# Altium project SPI-RFLOG V1.0.PrjPcb
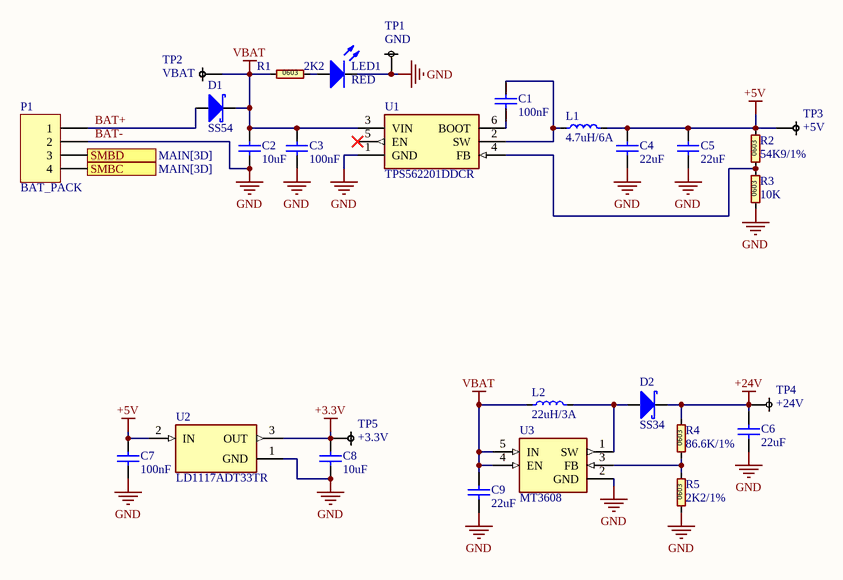
[diagram p0: PSU.SchDoc]
3 sheets, 129 parts. Net scope: flat (ports and power ports of the same name join across sheets).
Board file: RFLOG V1.0.PcbDoc
Sheets:
  PSU.SchDoc
  MAIN.SchDoc
  INTERFACE.SchDoc

## Sheet PSU.SchDoc
size A4; SheetNumber: 1; SheetTotal: 3

### Parts
C1  100nF  [C0603]
C2  10uF  [C1206]
C3  100nF  [C0603]
C4  22uF  [C0603]
C5  22uF  [C0603]
C6  22uF  [C1206]
C7  100nF  [C0603]
C8  10uF  [C1206]
C9  22uF  [C1206]
D1  SS54  [DO-214AC]
D2  SS34  [DO-214AC]
L1  4.7uH/6A  [IND_2926 (7467)]
L2  22uH/3A  [IND_2926 (7467)]
LED1  RED  [LED0603]
P1  BAT_PACK  [JST_XH-2.54]
R1  2K2  [R0603]
R2  54K9/1%  [R0603]
R3  10K  [R0603]
R4  86.6K/1%  [R0603]
R5  2K2/1%  [R0603]
TP1  GND  [PAD]
TP2  VBAT  [PAD]
TP3  +5V  [PAD]
TP4  +24V  [PAD_HOLE]
TP5  +3.3V  [PAD]
U1  TPS562201DDCR  [SOT-23-6]
U2  LD1117ADT33TR  [DPAK]
U3  MT3608  [SOT-23-6]

### Ports
SMBC (see MAIN[3D]), SMBD (see MAIN[3D])

### Nets
+3.3V: C8.2 TP5.1 U2.3(OUT)
+5V: C4.2 C5.2 C7.2 L1.2 R2.2 TP3.1 U2.2(IN)
+24V: C6.2 D2.C(K) R4.2 TP4.1
BAT-: C2.1 C3.1 C4.1 C5.1 C6.1 C7.1 C8.1 C9.1 LED1.2(K) P1.2 R3.1 R5.1 TP1.1 U1.1(GND) U2.1(GND) U3.2(GND)  [also labelled GND]
VBAT: C2.2 C3.2 C9.2 D1.C(K) L2.1 R1.1 TP2.1 U1.3(VIN) U3.4(EN) U3.5(IN)
BAT+: D1.A P1.1
NetC1_1: C1.1 U1.6(BOOT)
NetC1_2: C1.2 L1.1 U1.2(SW)
NetD2_A: D2.A L2.2 U3.1(SW)
NetJP2_1: P1.3 ; port SMBD
NetJP3_1: P1.4 ; port SMBC
NetLED1_1: LED1.1(A) R1.2
NetR2_1: R2.1 R3.2 U1.4(FB)
NetR4_1: R4.1 R5.2 U3.3(FB)

Not connected (* = marked no-connect by the designer): U1 5(EN)*

### Notes on the sheet
- Title:
- Author:
- Checked:
- Approved:
- Edited:
- CONFIDENTIAL
- Notes :
- Prj:
- github.com/abmnyy/about <https://github.com/abmnyy/about>
- Date:
- Version:
- Size:
- A4
- (in symbol Resistor 0603 (Inch)) 0603

### Library data of the parts
C1 = Capacitor 0603 (Inch): 0603 SMD Non-Polarity Capacitor; MFR.Part #: CC1206KRX7R9BB104; LCSC Part #: C82601; ComponentLink1Description: Datasheet; ComponentLink1URL: *
C2 = Capacitor 1206 (Inch): 1206 SMD Non-Polarity Capacitor; MFR.Part #: CC1206KKX5R9BB106; LCSC Part #: C100122; ComponentLink1Description: Datasheet; ComponentLink1URL: *
C3 C7 = Capacitor 0603 (Inch): 0603 SMD Non-Polarity Capacitor; MFR.Part #: *; LCSC Part #: *; ComponentLink1Description: Datasheet; ComponentLink1URL: *
C4 C5 = Capacitor 0603 (Inch): 0603 SMD Non-Polarity Capacitor; MFR.Part #: GRM188R61A226ME15D; LCSC Part #: C84419; ComponentLink1Description: Datasheet
  C4: ComponentLink1URL: *
  C5: ComponentLink1URL: https://www.lcsc.com/datasheet/C84419.pdf
C6 C9 = Capacitor 1206 (Inch): 1206 SMD Non-Polarity Capacitor; MFR.Part #: CC1206KKX5R8BB226; LCSC Part #: C2178233; ComponentLink1Description: Datasheet; ComponentLink1URL: *
C8 = Capacitor 1206 (Inch): 1206 SMD Non-Polarity Capacitor; MFR.Part #: *; LCSC Part #: *; ComponentLink1Description: Datasheet; ComponentLink1URL: *
D1 = SS54: 40V Independent 550mV@5A 5A SMA(DO-214AC) Schottky Diodes; MFR.Part #: SS54; LCSC Part #: C22452; ComponentLink1Description: Datasheet; ComponentLink1URL: https://www.lcsc.com/datasheet/C22452.pdf
D2 = SS34: Schottky SS34 DO-214AC; MFR.Part #: SS34; LCSC Part #: C3040628; ComponentLink1Description: Datasheet; ComponentLink1URL: https://www.lcsc.com/datasheet/C3040628.pdf
L1 = INDUCTOR 2926: Inductor with Package: 2926 (7467); MFR.Part #: FXL0630-4R7-M; LCSC Part #: C167220; ComponentLink1Description: Datasheet; ComponentLink1URL: https://www.lcsc.com/datasheet/C167220.pdf
L2 = INDUCTOR 2926: Inductor with Package: 2926 (7467); MFR.Part #: YSPI0630A-220M; LCSC Part #: C497873; ComponentLink1Description: Datasheet; ComponentLink1URL: https://www.lcsc.com/datasheet/C497873.pdf
LED1 = LED 0603: 0603 LED; MFR.Part #: KT-0603R; LCSC Part #: C2286; ComponentLink1Description: Datasheet; ComponentLink1URL: *
P1 = Connector 4P: CONNECTOR HEADER; LatestRevisionDate: 17-Jul-2002; LatestRevisionNote: Re-released for DXP Platform.; Publisher: Altium Limited
R1 R5 = Resistor 0603 (Inch): 0603 SMD Thick Resistor; MFR.Part #: RC0603JR-072K2L; LCSC Part #: C113303; ComponentLink1Description: Datasheet; ComponentLink1URL: *
R2 = Resistor 0603 (Inch): 0603 SMD Thick Resistor; MFR.Part #: RC0603FR-0754K9L; LCSC Part #: C185321; ComponentLink1Description: Datasheet; ComponentLink1URL: https://www.lcsc.com/datasheet/C185321.pdf
R3 = Resistor 0603 (Inch): 0603 SMD Thick Resistor; MFR.Part #: RC0603FR-0710KL; LCSC Part #: C98220; ComponentLink1Description: Datasheet; ComponentLink1URL: *
R4 = Resistor 0603 (Inch): 0603 SMD Thick Resistor; MFR.Part #: RC0603FR-0786K6L; LCSC Part #: C141683; ComponentLink1Description: Datasheet; ComponentLink1URL: https://www.lcsc.com/datasheet/C141683.pdf
TP1-TP5 = Test Point: Thick Pad
U1 = TPS562201DDCR: 4.5 V to 17 V input, 2 A output, synchronous step-down converter in Eco-mode; MFR.Part #: TPS562201DDCR; LCSC Part #: C90061; ComponentLink1Description: Datasheet; ComponentLink1URL: https://www.lcsc.com/datasheet/C90061.pdf
U2 = LD1117ADT33TR: Linear Voltage Regulator IC Positive Fixed 1 Output 3.3V 1A; MFR.Part #: LD1117ADT33TR; LCSC Part #: C157401; ComponentLink1Description: Datasheet; ComponentLink1URL: https://www.lcsc.com/datasheet/C157401.pdf
U3 = MT3608: High Efficiency 1.2MHz2A Step Up Converter; MFR.Part #: MT3608; LCSC Part #: C84817; ComponentLink1Description: Datasheet; ComponentLink1URL: https://www.lcsc.com/datasheet/C84817.pdf

## Sheet MAIN.SchDoc
size A4; SheetNumber: 2; SheetTotal: 3
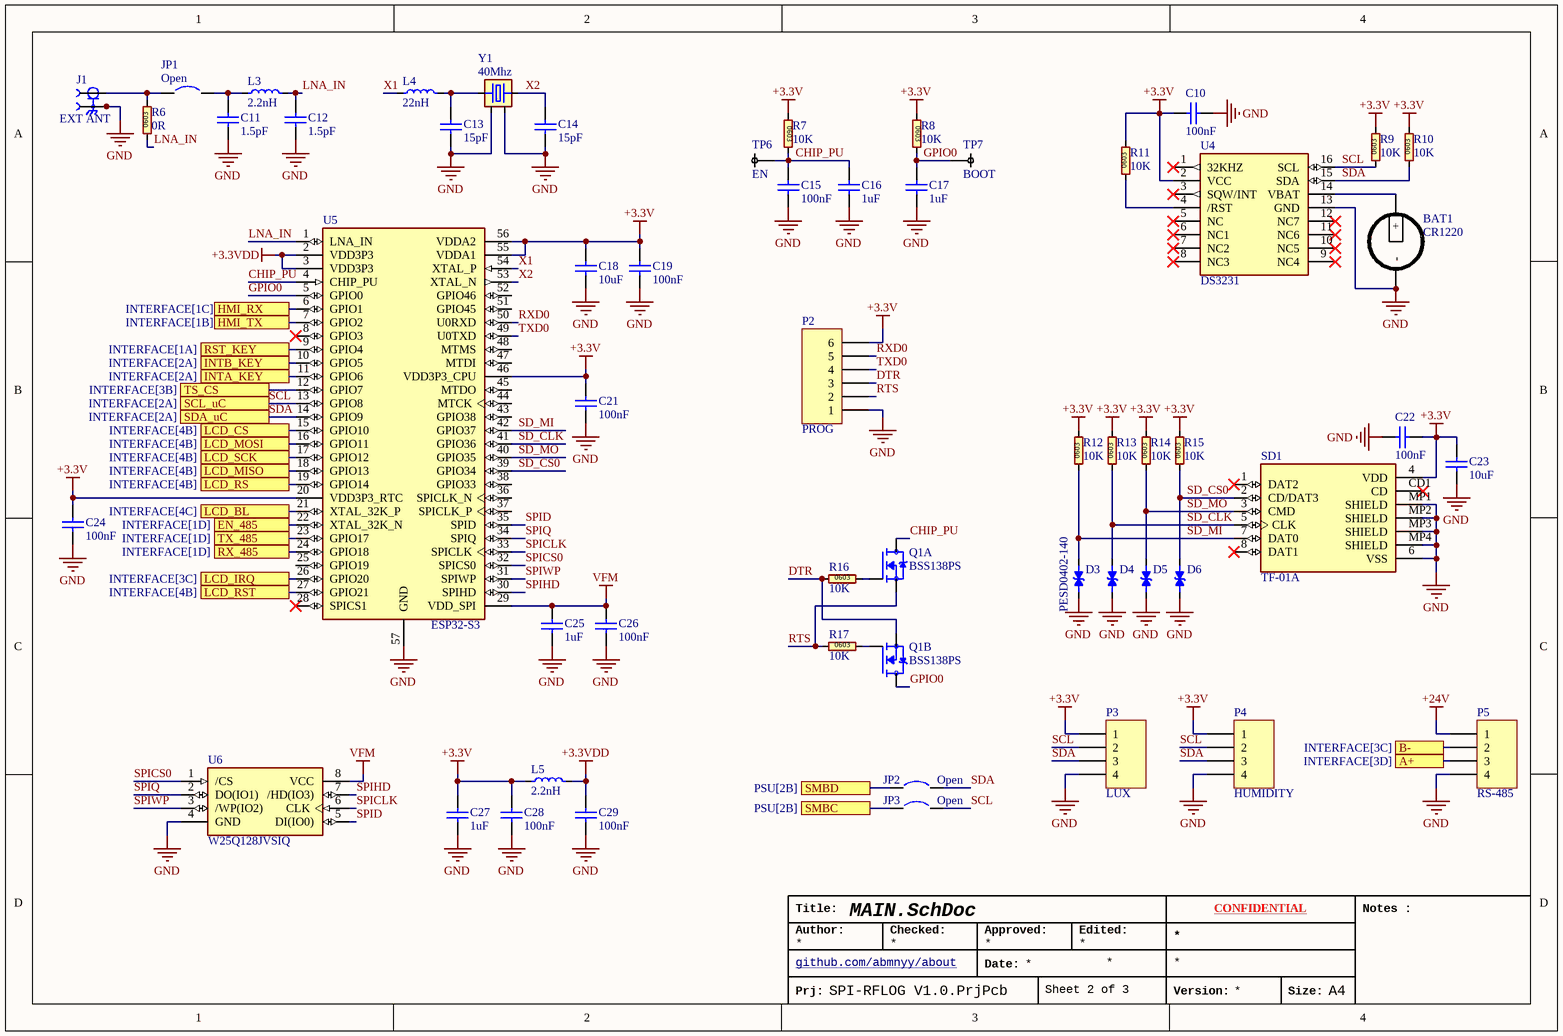
[diagram p1: MAIN.SchDoc]

### Parts
BAT1  CR1220  [MPD_BC501SM-TR]
C10  100nF  [C0603]
C11  1.5pF  [C0603]
C12  1.5pF  [C0603]
C13  15pF  [C0603]
C14  15pF  [C0603]
C15  100nF  [C0603]
C16  1uF  [C0603]
C17  1uF  [C0603]
C18  10uF  [C0603]
C19  100nF  [C0603]
C21  100nF  [C0603]
C22  100nF  [C0603]
C23  10uF  [C0603]
C24  100nF  [C0603]
C25  1uF  [C0603]
C26  100nF  [C0603]
C27  1uF  [C0603]
C28  100nF  [C0603]
C29  100nF  [C0603]
D3  PESD0402-140  [ESD0402]
D4  PESD0402-140  [ESD0402]  (value not drawn)
D5  PESD0402-140  [ESD0402]  (value not drawn)
D6  PESD0402-140  [ESD0402]  (value not drawn)
J1  EXT ANT  [IPEX_UF.L]
JP1  Open  [SB_STM]
JP2  Open  [SB_STM]
JP3  Open  [SB_STM]
L3  2.2nH  [L0603]
L4  22nH  [L0603]
L5  2.2nH  [L0603]
P2  PROG  [HDR-6P-2.54mm]
P3  LUX  [JST_XH-2.54]
P4  HUMIDITY  [JST_XH-2.54]
P5  RS-485  [JST_XH-2.54]
Q1  BSS138PS  [SOT-363]  (parts A,B of 2)
R6  0R  [R0603]
R7  10K  [R0603]
R8  10K  [R0603]
R9  10K  [R0603]
R10  10K  [R0603]
R11  10K  [R0603]
R12  10K  [R0603]
R13  10K  [R0603]
R14  10K  [R0603]
R15  10K  [R0603]
R16  10K  [R0603]
R17  10K  [R0603]
SD1  TF-01A  [TF-01A]
TP6  EN  [PAD]
TP7  BOOT  [PAD]
U4  DS3231  [SOIC-16-WIDE]
U5  ESP32-S3  [ESP32-S3]
U6  W25Q128JVSIQ  [SOIC-8-208miL]
Y1  40Mhz  [OSC_SMD3225-4]

### Ports
A+ (see INTERFACE[3D]), B- (see INTERFACE[3C]), EN_485 (see INTERFACE[1D]), HMI_RX (see INTERFACE[1C]), HMI_TX (see INTERFACE[1B]), INTA_KEY (see INTERFACE[2A]), INTB_KEY (see INTERFACE[2A]), LCD_BL (see INTERFACE[4C]), LCD_CS (see INTERFACE[4B]), LCD_IRQ (see INTERFACE[3C]), LCD_MISO (see INTERFACE[4B]), LCD_MOSI (see INTERFACE[4B]), LCD_RS (see INTERFACE[4B]), LCD_RST (see INTERFACE[4B]), LCD_SCK (see INTERFACE[4B]), RST_KEY (see INTERFACE[1A]), RX_485 (see INTERFACE[1D]), SCL_uC (see INTERFACE[2A]), SDA_uC (see INTERFACE[2A]), SMBC (see PSU[2B]), SMBD (see PSU[2B]), TS_CS (see INTERFACE[3B]), TX_485 (see INTERFACE[1D])

### Nets
+3.3V: C10.2 C18.2 C19.2 C21.2 C22.1 C23.2 C24.2 C27.2 C28.2 L5.1 P2.6 P3.1 P4.1 R7.1 R8.1 R9.2 R10.2 R11.2 R12.2 R13.2 R14.2 R15.2 SD1.4(VDD) U4.2(VCC) U5.20(VDD3P3_RTC) U5.46(VDD3P3_CPU) U5.55(VDDA1) U5.56(VDDA2)
+3.3VDD: C29.2 L5.2 U5.2(VDD3P3) U5.3(VDD3P3)
+24V: P5.1
GND: BAT1.- C10.1 C11.1 C12.1 C13.1 C14.1 C15.2 C16.2 C17.2 C18.1 C19.1 C21.1 C22.2 C23.1 C24.1 C25.1 C26.1 C27.1 C28.1 C29.1 D3.1 D4.1 D5.1 D6.1 J1.2(GROUND) J1.3(GROUND) P2.1 P3.4 P4.4 P5.4 SD1.6(VSS) SD1.MP1(SHIELD) SD1.MP2(SHIELD) SD1.MP3(SHIELD) SD1.MP4(SHIELD) U4.13(GND) U5.57(GND) U6.4(GND) Y1.2(GND) Y1.4(GND)  [project net BAT-]
VFM: C25.2 C26.2 U5.29(VDD_SPI) U6.8(VCC)
CHIP_PU: C15.1 C16.1 Q1.6(D1) R7.2 TP6.1 U5.4(CHIP_PU)
DTR: P2.3 Q1.4(S2) R16.1
GPIO0: C17.1 Q1.3(D2) R8.2 TP7.1 U5.5(GPIO0)
LNA_IN: C12.2 L3.2 R6.1 U5.1(LNA_IN)
RTS: P2.2 Q1.1(S1) R17.1
RXD0: P2.5 U5.50(U0RXD)
SCL: JP3.2 P3.2 P4.2 R9.1 U4.16(SCL) U5.13(GPIO8) ; port SCL_uC
SD_CLK: D4.2 R13.1 SD1.5(CLK) U5.41(GPIO36)
SD_CS0: D6.2 R15.1 SD1.2(CD/DAT3) U5.39(GPIO34)
SD_MI: D3.2 R12.1 SD1.7(DAT0) U5.42(GPIO37)
SD_MO: D5.2 R14.1 SD1.3(CMD) U5.40(GPIO35)
SDA: JP2.2 P3.3 P4.3 R10.1 U4.15(SDA) U5.14(GPIO9) ; port SDA_uC
SPICLK: U5.33(SPICLK) U6.6(CLK)
SPICS0: U5.32(SPICS0) U6.1(/CS)
SPID: U5.35(SPID) U6.5(DI(IO0))
SPIHD: U5.30(SPIHD) U6.7(/HD(IO3))
SPIQ: U5.34(SPIQ) U6.2(DO(IO1))
SPIWP: U5.31(SPIWP) U6.3(/WP(IO2))
TS_MISO: U5.18(GPIO13) ; port LCD_MISO
TS_MOSI: U5.16(GPIO11) ; port LCD_MOSI
TS_SCK: U5.17(GPIO12) ; port LCD_SCK
TXD0: P2.4 U5.49(U0TXD)
X1: L4.1 U5.54(XTAL_P)
X2: C14.2 U5.53(XTAL_N) Y1.3(OSC2)
NetBAT1_+: BAT1.+ U4.14(VBAT)
NetC11_2: C11.2 JP1.2 L3.1
NetC13_2: C13.2 L4.2 Y1.1(OSC1)
NetF1_2: P5.2 ; port B-
NetF2_2: P5.3 ; port A+
NetIC1_11: U5.26(GPIO20) ; port LCD_IRQ
NetIC1_15: U5.12(GPIO7) ; port TS_CS
NetJ1_1: J1.1(SIGNAL) JP1.1 R6.2
NetJ2_9: U5.15(GPIO10) ; port LCD_CS
NetJ2_10: U5.19(GPIO14) ; port LCD_RS
NetJ2_15: U5.27(GPIO21) ; port LCD_RST
NetJP2_1: JP2.1 ; port SMBD
NetJP3_1: JP3.1 ; port SMBC
NetQ1_2: Q1.2(G1) R16.2
NetQ1_5: Q1.5(G2) R17.2
NetQ2_1: U5.7(GPIO2) ; port HMI_TX
NetQ2_4: U5.6(GPIO1) ; port HMI_RX
NetR11_1: R11.1 U4.4(/RST)
NetR18_1: U5.10(GPIO5) ; port INTB_KEY
NetR19_1: U5.11(GPIO6) ; port INTA_KEY
NetR20_1: U5.9(GPIO4) ; port RST_KEY
NetR26_2: U5.21(XTAL_32K_P) ; port LCD_BL
NetR30_1: U5.23(GPIO17) ; port TX_485
NetR31_1: U5.22(XTAL_32K_N) ; port EN_485
NetR32_1: U5.24(GPIO18) ; port RX_485

Not connected (* = marked no-connect by the designer): SD1 1(DAT2)* 8(DAT1)* CD1(CD)*; U4 1(32KHZ)* 3(SQW/INT)* 5(NC)* 6(NC1)* 7(NC2)* 8(NC3)* 9(NC4)* 10(NC5)* 11(NC6)* 12(NC7)*; U5 8(GPIO3)* 25(GPIO19) 28(SPICS1)* 36(SPICLK_N) 37(SPICLK_P) 38(GPIO33) 43(GPIO38) 44(MTCK) 45(MTDO) 47(MTDI) 48(MTMS) 51(GPIO45) 52(GPIO46)

### Notes on the sheet
- Title:
- Author:
- Checked:
- Approved:
- Edited:
- CONFIDENTIAL
- Notes :
- Prj:
- github.com/abmnyy/about <https://github.com/abmnyy/about>
- Date:
- Version:
- Size:
- A4
- (in symbol Resistor 0603 (Inch)) 0603

### Library data of the parts
BAT1 = CR1220 HOLDER: BATTERY HOLDER; MFR.Part #: BC501SM; LCSC Part #: C5439670; ComponentLink1Description: Datasheet; ComponentLink1URL: https://www.lcsc.com/datasheet/lcsc_datasheet_2410121528_MPD--Memory-Protection-Devices-BC501SM_C5439670.pdf
C10 C15 C19 C21-C29 = Capacitor 0603 (Inch): 0603 SMD Non-Polarity Capacitor; MFR.Part #: *; LCSC Part #: *; ComponentLink1Description: Datasheet; ComponentLink1URL: *
C11 C12 = Capacitor 0603 (Inch): 0603 SMD Non-Polarity Capacitor; MFR.Part #: CC0603CRNPO9BN1R5; LCSC Part #: C163551; ComponentLink1Description: Datasheet
  C11: ComponentLink1URL: https://www.lcsc.com/datasheet/C163551.pdf
  C12: ComponentLink1URL: *
C13 C14 = Capacitor 0603 (Inch): 0603 SMD Non-Polarity Capacitor; MFR.Part #: X322540MPB4SI; LCSC Part #: C9010; ComponentLink1Description: Datasheet
  C13: ComponentLink1URL: https://www.lcsc.com/datasheet/C9010.pdf
  C14: ComponentLink1URL: *
C16 C17 = Capacitor 0603 (Inch): 0603 SMD Non-Polarity Capacitor; MFR.Part #: CC0603KRX7R7BB105; LCSC Part #: C106248; ComponentLink1Description: Datasheet; ComponentLink1URL: *
C18 = Capacitor 0603 (Inch): 0603 SMD Non-Polarity Capacitor; MFR.Part #: CC0603MRX5R7BB106; LCSC Part #: C109457; ComponentLink1Description: Datasheet; ComponentLink1URL: *
D3-D6 = PESD0402-140: 40V Bidirectional 14V 0402 ESD and Surge Protection (TVS/ESD) ROHS; MFR.Part #: PESD0402-140; LCSC Part #: C10662
  D3: ComponentLink1Description: Datasheet; ComponentLink1URL: https://www.lcsc.com/datasheet/C10662.pdf
J1 = IPEX UF.L: 1 POS Vertical SMD Small form factor with big performance through 6 GHz connector,MHF, RF, micro-coaxial MHF I Receptacle; MFR.Part #: KH-IPEX-K501-29; LCSC Part #: C411563; ComponentLink1Description: Datasheet; ComponentLink1URL: https://www.lcsc.com/datasheet/C411563.pdf
JP1-JP3 = Jumper Solder: Jumper Solder Pad; Published: 24-Mar-1999; Revision: July-2002: Re-released for DXP Platform.; Publisher: Altium Limited
L3 = INDUCTOR 0603: Inductor with Package: 0603 Inch; MFR.Part #: *; LCSC Part #: *; ComponentLink1Description: Datasheet; ComponentLink1URL: *
L4 = INDUCTOR 0603: Inductor with Package: 0603 Inch; MFR.Part #: VHF160808H22NJT; LCSC Part #: C90207; ComponentLink1Description: Datasheet; ComponentLink1URL: https://www.lcsc.com/datasheet/C90207.pdf
L5 = INDUCTOR 0603: Inductor with Package: 0603 Inch; MFR.Part #: LQW18AN2N2C80D; LCSC Part #: C71648; ComponentLink1Description: Datasheet; ComponentLink1URL: https://www.lcsc.com/datasheet/C71648.pdf
P2 = Header 6: Header, 6-Pin; LatestRevisionDate: 17-Jul-2002; LatestRevisionNote: Re-released for DXP Platform.; Publisher: Altium Limited
P3-P5 = Connector 4P: CONNECTOR HEADER; LatestRevisionDate: 17-Jul-2002; LatestRevisionNote: Re-released for DXP Platform.; Publisher: Altium Limited
Q1 = BSS138PS: 60 V, 320 mA dual N-channel Trench MOSFET; MFR.Part #: BSS138PS,115; LCSC Part #: C193381; ComponentLink1Description: Datasheet; ComponentLink1URL: https://www.lcsc.com/datasheet/lcsc_datasheet_2410121736_Nexperia-BSS138PS-115_C193381.pdf
R6 = Resistor 0603 (Inch): 0603 SMD Thick Resistor; MFR.Part #: AC0603FR-070RL; LCSC Part #: C116699; ComponentLink1Description: Datasheet; ComponentLink1URL: *
R7-R17 = Resistor 0603 (Inch): 0603 SMD Thick Resistor; MFR.Part #: *; LCSC Part #: *; ComponentLink1Description: Datasheet; ComponentLink1URL: *
SD1 = TF-01A: Standard Card Edge Connectors; LCSC Part #: C2889258; MFR.Part #: TF-01A; ComponentLink1Description: Datasheet; ComponentLink1URL: https://www.lcsc.com/datasheet/C2889258.pdf
TP6 TP7 = Test Point: Thick Pad
U4 = DS3231: Real Time Clock (RTC) IC Clock/Calendar - IÂ²C, 2-Wire Serial 8-SOIC (0.154, 3.90mm Width); MFR.Part #: DS3231SN#T&R; LCSC Part #: C9866; ComponentLink1Description: Datasheet; ComponentLink1URL: https://www.lcsc.com/datasheet/C9866.pdf
U5 = ESP32-S3: IC RF TxRx + MCU Bluetooth, WiFi 802.11b/g/n, Bluetooth v5.0 2.412GHz ~ 2.484GHz 56-VFQFN Exposed Pad; MFR.Part #: ESP32-S3R8; LCSC Part #: C2913194; ComponentLink1Description: Datasheet; ComponentLink1URL: https://www.lcsc.com/datasheet/C2913194.pdf
U6 = W25Q128JVSIQ: FLASH - NOR Memory IC 128Mb (16M x 8) SPI - Quad I/O, QPI, DTR 133 MHz 8-SOIC; MFR.Part #: W25Q128JVSIQ; LCSC Part #: C97521; ComponentLink1Description: Datasheet; ComponentLink1URL: https://www.lcsc.com/datasheet/C97521.pdf
Y1 = XTAL-40Mhz: 40MHz Crystal Oscillator 15pF ±10ppm ±20ppm SMD3225-4P Crystals ROHS; MFR.Part #: X322540MPB4SI; LCSC Part #: C9010; ComponentLink1Description: Datasheet; ComponentLink1URL: https://www.lcsc.com/datasheet/C9010.pdf

## Sheet INTERFACE.SchDoc
size A4; SheetNumber: 3; SheetTotal: 3
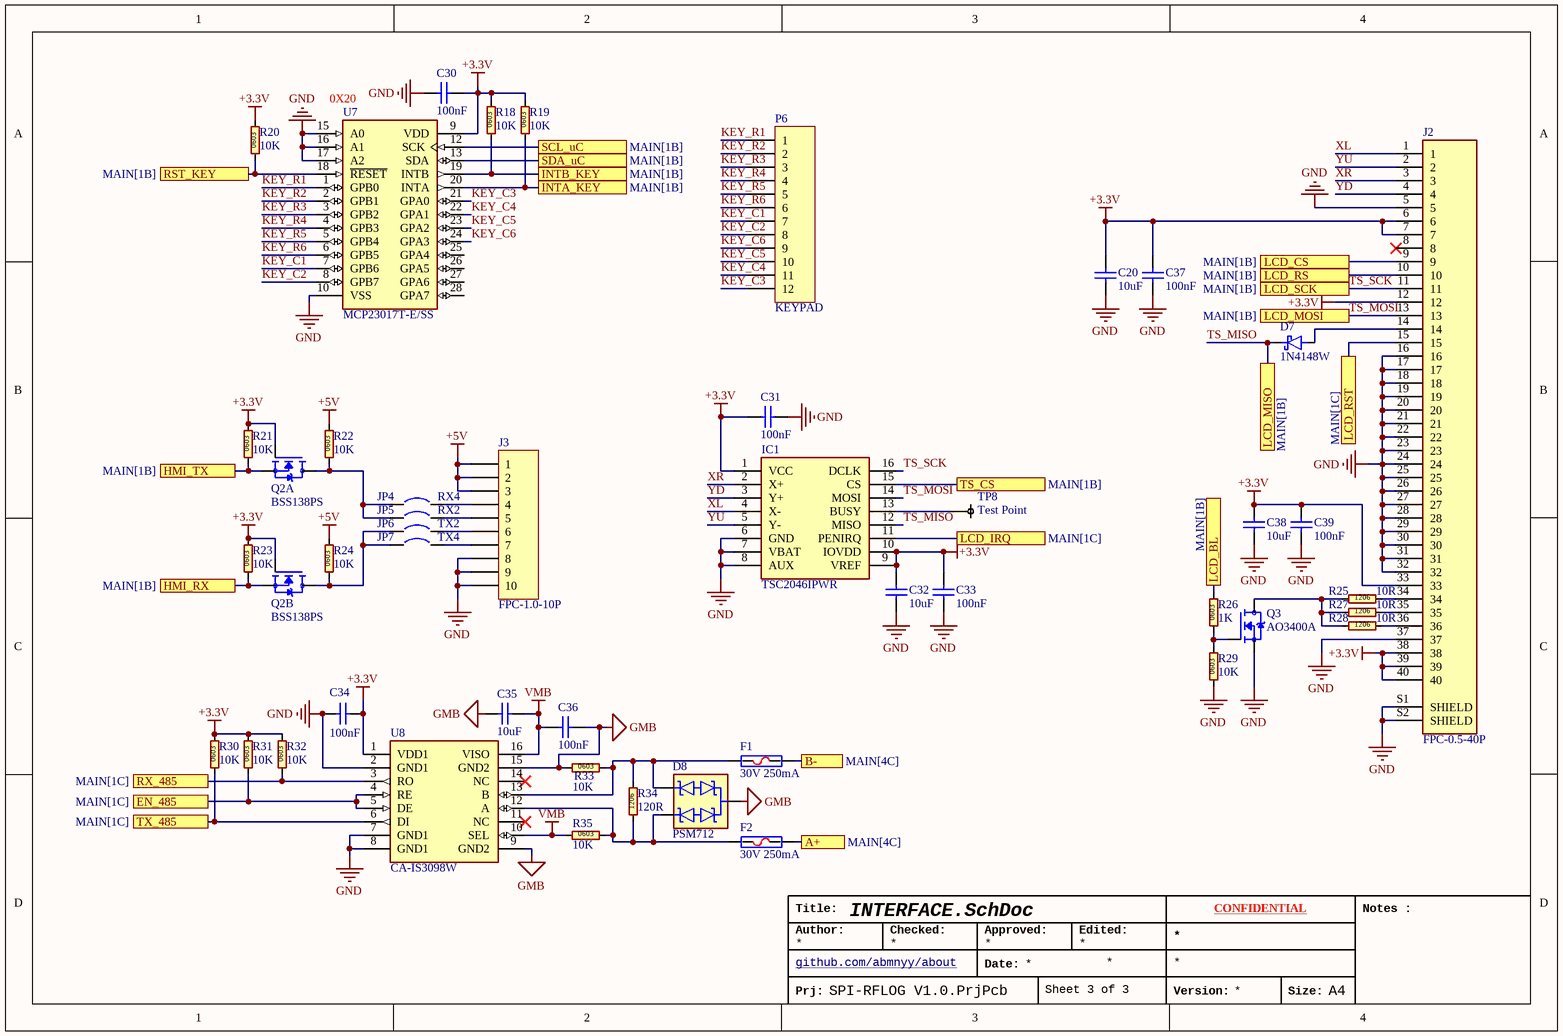
[diagram p2: INTERFACE.SchDoc]

### Parts
C20  10uF  [C0603]
C30  100nF  [C0603]
C31  100nF  [C0603]
C32  10uF  [C0603]
C33  100nF  [C0603]
C34  100nF  [C0603]
C35  10uF  [C0603]
C36  100nF  [C0603]
C37  100nF  [C0603]
C38  10uF  [C0603]
C39  100nF  [C0603]
D7  1N4148W  [SOD-123F]
D8  PSM712  [SOT-23-3]
F1  30V 250mA  [PPTC-1206]
F2  30V 250mA  [PPTC-1206]
IC1  TSC2046IPWR  [TSSOP-16]
J2  FPC-0.5-40P  [FPC_0.5_40P - TOP CONTACT - duplicate]
J3  FPC-1.0-10P  [FPC_1.0_10P - BOTTOM CONTACT]
JP4  RX4  [SB_STM]
JP5  RX2  [SB_STM]
JP6  TX2  [SB_STM]
JP7  TX4  [SB_STM]
P6  KEYPAD  [HDR-12P-2.54mm]
Q2  BSS138PS  [SOT-363]  (parts A,B of 2)
Q3  AO3400A  [SOT-23-3]
R18  10K  [R0603]
R19  10K  [R0603]
R20  10K  [R0603]
R21  10K  [R0603]
R22  10K  [R0603]
R23  10K  [R0603]
R24  10K  [R0603]
R25  10R  [R1206]
R26  1K  [R0603]
R27  10R  [R1206]
R28  10R  [R1206]
R29  10K  [R0603]
R30  10K  [R0603]
R31  10K  [R0603]
R32  10K  [R0603]
R33  10K  [R0603]
R34  120R  [R1206]
R35  10K  [R0603]
TP8  Test Point  [PAD]
U7  MCP23017T-E/SS  [SSOP-28]
U8  CA-IS3098W  [SOIC-16-WIDE]

### Ports
A+ (see MAIN[4C]), B- (see MAIN[4C]), EN_485 (see MAIN[1C]), HMI_RX (see MAIN[1B]), HMI_TX (see MAIN[1B]), INTA_KEY (see MAIN[1B]), INTB_KEY (see MAIN[1B]), LCD_BL (see MAIN[1B]), LCD_CS (see MAIN[1B]), LCD_IRQ (see MAIN[1C]), LCD_MISO (see MAIN[1B]), LCD_MOSI (see MAIN[1B]), LCD_RS (see MAIN[1B]), LCD_RST (see MAIN[1C]), LCD_SCK (see MAIN[1B]), RST_KEY (see MAIN[1B]), RX_485 (see MAIN[1C]), SCL_uC (see MAIN[1B]), SDA_uC (see MAIN[1B]), TS_CS (see MAIN[1B]), TX_485 (see MAIN[1C])

### Nets
+3.3V: C20.1 C30.2 C31.2 C32.1 C33.2 C34.2 C37.2 C38.1 C39.2 IC1.1(VCC) IC1.9(VREF) IC1.10(IOVDD) J2.6 J2.7 J2.12 J2.33 J2.38 J2.39 J2.40 Q2.2(G1) Q2.5(G2) R18.2 R19.2 R20.2 R21.2 R23.2 R30.2 R31.2 R32.2 U7.9(VDD) U8.1(VDD1)
+5V: J3.1 J3.2 J3.3 R22.2 R24.2
GMB: C35.2 C36.2 D8.3 R33.1 U8.9(GND2) U8.15(GND2)
GND: C20.2 C30.1 C31.1 C32.2 C33.1 C34.1 C37.1 C38.2 C39.1 IC1.6(GND) IC1.7(VBAT) IC1.8(AUX) J2.5 J2.16 J2.17 J2.18 J2.19 J2.20 J2.21 J2.22 J2.23 J2.24 J2.25 J2.26 J2.27 J2.28 J2.29 J2.30 J2.31 J2.32 J2.37 J2.S1(SHIELD) J2.S2(SHIELD) J3.8 J3.9 J3.10 Q3.2(S) R29.1 U7.10(VSS) U7.15(A0) U7.16(A1) U7.17(A2) U8.2(GND1) U8.7(GND1) U8.8(GND1)  [project net BAT-]
VMB: C35.1 C36.1 R35.1 U8.10(SEL) U8.16(VISO)
KEY_C1: P6.7 U7.7(GPB6)
KEY_C2: P6.8 U7.8(GPB7)
KEY_C3: P6.12 U7.21(GPA0)
KEY_C4: P6.11 U7.22(GPA1)
KEY_C5: P6.10 U7.23(GPA2)
KEY_C6: P6.9 U7.24(GPA3)
KEY_R1: P6.1 U7.1(GPB0)
KEY_R2: P6.2 U7.2(GPB1)
KEY_R3: P6.3 U7.3(GPB2)
KEY_R4: P6.4 U7.4(GPB3)
KEY_R5: P6.5 U7.5(GPB4)
KEY_R6: P6.6 U7.6(GPB5)
SCL: U7.12(SCK) ; port SCL_uC
SDA: U7.13(SDA) ; port SDA_uC
TS_MISO: D7.K IC1.12(MISO) ; port LCD_MISO
TS_MOSI: IC1.14(MOSI) J2.13 ; port LCD_MOSI
TS_SCK: IC1.16(DCLK) J2.11 ; port LCD_SCK
XL: IC1.4(X-) J2.1
XR: IC1.2(X+) J2.3
YD: IC1.3(Y+) J2.4
YU: IC1.5(Y-) J2.2
NetD7_A: D7.A J2.14
NetD8_1: D8.1 F1.1 R33.2 R34.2 U8.13(B)
NetD8_2: D8.2 F2.1 R34.1 R35.2 U8.12(A)
NetF1_2: F1.2 ; port B-
NetF2_2: F2.2 ; port A+
NetIC1_11: IC1.11(PENIRQ) ; port LCD_IRQ
NetIC1_13: IC1.13(BUSY) TP8.1
NetIC1_15: IC1.15(CS) ; port TS_CS
NetJ2_9: J2.9 ; port LCD_CS
NetJ2_10: J2.10 ; port LCD_RS
NetJ2_15: J2.15 ; port LCD_RST
NetJ2_34: J2.34 R25.2
NetJ2_35: J2.35 R27.2
NetJ2_36: J2.36 R28.2
NetJ3_4: J3.4 JP4.2
NetJ3_5: J3.5 JP5.2
NetJ3_6: J3.6 JP6.2
NetJ3_7: J3.7 JP7.2
NetJP4_1: JP4.1 JP5.1 Q2.6(D1) R22.1
NetJP6_1: JP6.1 JP7.1 Q2.3(D2) R24.1
NetQ2_1: Q2.1(S1) R21.1 ; port HMI_TX
NetQ2_4: Q2.4(S2) R23.1 ; port HMI_RX
NetQ3_1: Q3.1(G) R26.1 R29.2
NetQ3_3: Q3.3(D) R25.1 R27.1 R28.1
NetR18_1: R18.1 U7.19(INTB) ; port INTB_KEY
NetR19_1: R19.1 U7.20(INTA) ; port INTA_KEY
NetR20_1: R20.1 U7.18(~{RESET}) ; port RST_KEY
NetR26_2: R26.2 ; port LCD_BL
NetR30_1: R30.1 U8.6(DI) ; port TX_485
NetR31_1: R31.1 U8.4(RE) U8.5(DE) ; port EN_485
NetR32_1: R32.1 U8.3(RO) ; port RX_485

Not connected (* = marked no-connect by the designer): J2 8*; U7 25(GPA4) 26(GPA5) 27(GPA6) 28(GPA7); U8 11(NC)* 14(NC)*

### Notes on the sheet
- (near U7) 0X20
- Title:
- Author:
- Checked:
- Approved:
- Edited:
- CONFIDENTIAL
- Notes :
- Prj:
- github.com/abmnyy/about <https://github.com/abmnyy/about>
- Date:
- Version:
- Size:
- A4
- (in symbol Resistor 0603 (Inch)) 0603
- (in symbol Resistor 1206 (Inch)) 1206

### Library data of the parts
C20 C30-C39 = Capacitor 0603 (Inch): 0603 SMD Non-Polarity Capacitor; MFR.Part #: *; LCSC Part #: *; ComponentLink1Description: Datasheet; ComponentLink1URL: *
D7 = 1N4148W: 75V Independent 1V@50mA 4ns 150mA SOD-123 Switching Diodes ROHS; MFR.Part #: 1N4148W; LCSC Part #: C81598; ComponentLink1Description: Datasheet; ComponentLink1URL: https://www.lcsc.com/datasheet/C81598.pdf
D8 = PSM712: 31V, 19V Clamp 19A (8/20µs) Ipp Tvs Diode; MFR.Part #: PSM712-LF-T7; LCSC Part #: C2687124; ComponentLink1Description: Datasheet; ComponentLink1URL: https://lcsc.com/datasheet/lcsc_datasheet_2311091738_UMW-Youtai-Semiconductor-Co---Ltd--PSM712-LF-T7_C2687124.pdf
F1 F2 = PPTC 1206: PPTC RESET FUSE; MFR.Part #: BSMD1206-010-30V; LCSC Part #: C5373977; ComponentLink1Description: Datasheet
  F1: ComponentLink1URL: https://www.lcsc.com/datasheet/C5373977.pdf
  F2: ComponentLink1URL: *
IC1 = TSC2046IPWR: 12 2V~5.25V TSSOP-16 Touch Screen Controllers ROHS; MFR.Part #: TSC2046IPWR; LCSC Part #: C8954; ComponentLink1Description: Datasheet; ComponentLink1URL: https://www.lcsc.com/datasheet/C8954.pdf
J2 = FPC-0.5-40P: Connector: FFC / FPC; horizontal; PIN: 40; ZIF, top contacts; SMT; MFR.Part #: AFC07-S40ECA-00; LCSC Part #: C262648; ComponentLink1Description: Datasheet; ComponentLink1URL: *
J3 = FPC-1.0-10P: Connector: FFC / FPC; horizontal; PIN: 10; ZIF; MFR.Part #: BX-FPC1.0-2H10PX; LCSC Part #: C18077668
JP4-JP7 = Jumper Solder: Jumper Solder Pad; Published: 24-Mar-1999; Revision: July-2002: Re-released for DXP Platform.; Publisher: Altium Limited
P6 = Header 12: Header, 12-Pin; LatestRevisionDate: 17-Jul-2002; LatestRevisionNote: Re-released for DXP Platform.; Publisher: Altium Limited
Q2 = BSS138PS: as Q1 on sheet MAIN; LCSC Part #: C193381; ComponentLink1Description: Datasheet; ComponentLink1URL: https://www.lcsc.com/datasheet/lcsc_datasheet_2410121736_Nexperia-BSS138PS-115_C193381.pdf
Q3 = AO3400A: N-Channel 30 V 5.8A 1.4W; MFR.Part #: AO3400A; LCSC Part #: C20917; ComponentLink1Description: Datasheet; ComponentLink1URL: https://www.lcsc.com/datasheet/lcsc_datasheet_2410121838_Alpha---Omega-Semicon-AO3400A_C20917.pdf
R18-R24 R29-R33 R35 = Resistor 0603 (Inch): 0603 SMD Thick Resistor; MFR.Part #: *; LCSC Part #: *; ComponentLink1Description: Datasheet; ComponentLink1URL: *
R25 R27 R28 = Resistor 1206 (Inch): 1206 SMD Thick Resistor; MFR.Part #: RC1206FR-0710RL; LCSC Part #: C108080; ComponentLink1Description: Datasheet
  R25: ComponentLink1URL: https://www.lcsc.com/datasheet/C108080.pdf
  R27 R28: ComponentLink1URL: *
R26 = Resistor 0603 (Inch): 0603 SMD Thick Resistor; MFR.Part #: RC0603JR-071KL; LCSC Part #: C14676; ComponentLink1Description: Datasheet; ComponentLink1URL: *
R34 = Resistor 1206 (Inch): 1206 SMD Thick Resistor; MFR.Part #: RC1206FR-07120RL; LCSC Part #: C114928; ComponentLink1Description: Datasheet; ComponentLink1URL: *
TP8 = Test Point: Thick Pad
U7 = MCP23017T-E/SS: 16-bit Input/Output Expander, I2C interface, Pb-free28 SSOP .209in T/R | Microchip Technology Inc. MCP23017T-E/SS; MFR.Part #: MCP23017T-E/SS; LCSC Part #: C558584; ComponentLink1Description: Datasheet; ComponentLink1URL: https://www.lcsc.com/datasheet/C558584.pdf
U8 = CA-IS3098W: SOIC16-WB(W) Isolated RS-485/422 Transceivers with power, 20Mbps; MFR.Part #: CA-IS3098W; LCSC Part #: C7422557; ComponentLink1Description: Datasheet; ComponentLink1URL: https://www.lcsc.com/datasheet/C7422557.pdf

## Nets that join several sheets
+3.3V: PSU (C8.2 TP5.1 U2.3), MAIN (28 pins), INTERFACE (31 pins)
+5V: PSU (7 pins), INTERFACE (5 pins)
+24V: PSU (C6.2 D2.C R4.2 TP4.1), MAIN (P5.1)
BAT-: PSU (16 pins), MAIN (40 pins), INTERFACE (45 pins)
NetF1_2: MAIN (P5.2), INTERFACE (F1.2)
NetF2_2: MAIN (P5.3), INTERFACE (F2.2)
NetIC1_11: MAIN (U5.26), INTERFACE (IC1.11)
NetIC1_15: MAIN (U5.12), INTERFACE (IC1.15)
NetJ2_9: MAIN (U5.15), INTERFACE (J2.9)
NetJ2_10: MAIN (U5.19), INTERFACE (J2.10)
NetJ2_15: MAIN (U5.27), INTERFACE (J2.15)
NetJP2_1: PSU (P1.3), MAIN (JP2.1)
NetJP3_1: PSU (P1.4), MAIN (JP3.1)
NetQ2_1: MAIN (U5.7), INTERFACE (Q2.1 R21.1)
NetQ2_4: MAIN (U5.6), INTERFACE (Q2.4 R23.1)
NetR18_1: MAIN (U5.10), INTERFACE (R18.1 U7.19)
NetR19_1: MAIN (U5.11), INTERFACE (R19.1 U7.20)
NetR20_1: MAIN (U5.9), INTERFACE (R20.1 U7.18)
NetR26_2: MAIN (U5.21), INTERFACE (R26.2)
NetR30_1: MAIN (U5.23), INTERFACE (R30.1 U8.6)
NetR31_1: MAIN (U5.22), INTERFACE (R31.1 U8.4 U8.5)
NetR32_1: MAIN (U5.24), INTERFACE (R32.1 U8.3)
SCL: MAIN (6 pins), INTERFACE (U7.12)
SDA: MAIN (6 pins), INTERFACE (U7.13)
TS_MISO: MAIN (U5.18), INTERFACE (D7.K IC1.12)
TS_MOSI: MAIN (U5.16), INTERFACE (IC1.14 J2.13)
TS_SCK: MAIN (U5.17), INTERFACE (IC1.16 J2.11)